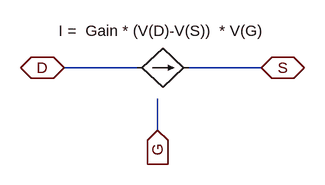
[diagram p0: schematic gabar.asc]
gabar.asc, the LTspice schematic file:
Version 4
SHEET 1 880 680
WIRE 128 112 16 112
WIRE 320 112 208 112
WIRE 160 208 160 160
FLAG 16 112 D
IOPIN 16 112 BiDir
FLAG 160 208 G
IOPIN 160 208 In
FLAG 320 112 S
IOPIN 320 112 BiDir
SYMBOL bi2 208 112 R90
WINDOW 0 50 104 Invisible 2
WINDOW 3 -72 42 VTop 2
SYMATTR InstName B1
SYMATTR Value I =  Gain * (V(D)-V(S))  * V(G)

The netlist it stands for:
* gabar.asc
B1 D S I =  Gain * (V(D)-V(S))  * V(G)
.backanno
.end